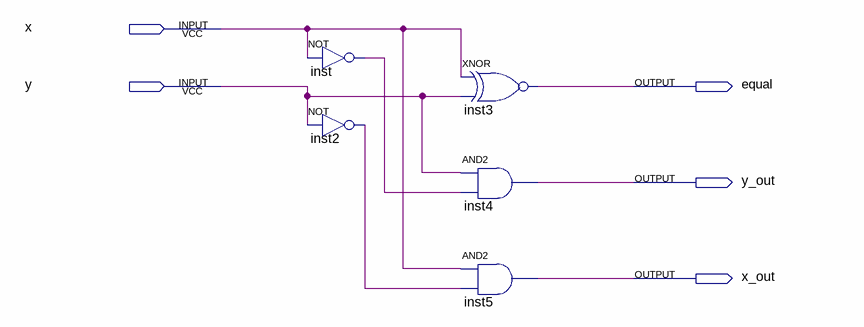
[diagram p0: schematic sheet]
// Quartus schematic 1BitComparator.bdf as structural Verilog: 5 symbols, 5 pins
module \1BitComparator  (
  input  x,
  input  y,
  output equal,
  output y_out,
  output x_out
);

  wire inst2_out, inst_out;

  not inst (inst_out, x);
  not inst2 (inst2_out, y);
  xnor inst3 (equal, x, y);
  and inst4 (y_out, y, inst_out);
  and inst5 (x_out, x, inst2_out);
endmodule
